# Altium schematic sheet STM32F1Debugger.SchDoc
size A4; SheetNumber: 1; SheetTotal: 16
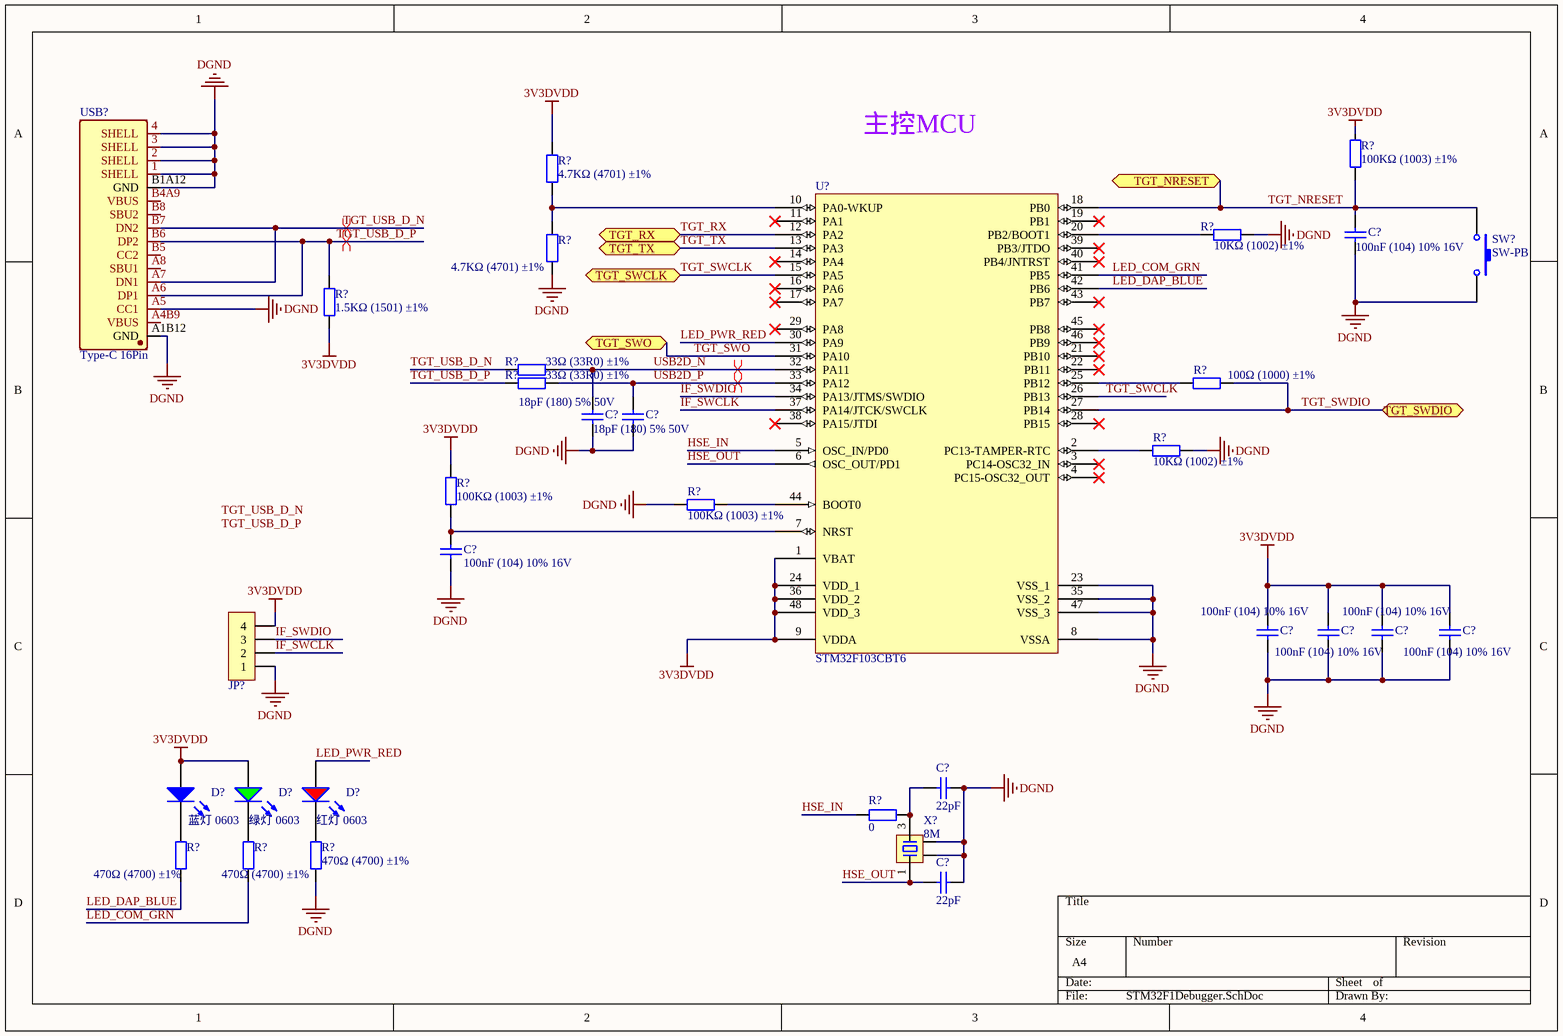
[diagram p0: STM32F1Debugger.SchDoc]

## Parts
(Parts that share a designator on the sheet are numbered #1, #2 ... from top to bottom, then left to right.)
C?#1  100nF (104) 10% 16V  [0402_C]
C?#2  18pF (180) 5% 50V  [0402_C]
C?#3  18pF (180) 5% 50V  [0402_C]
C?#4  100nF (104) 10% 16V  [0402_C]
C?#5  100nF (104) 10% 16V  [0402_C]
C?#6  100nF (104) 10% 16V  [0402_C]
C?#7  100nF (104) 10% 16V  [0402_C]
C?#8  100nF (104) 10% 16V  [0402_C]
C?#9  22pF  [0603_C]
C?#10  22pF  [0603_C]
D?#1  蓝灯 0603  [0603_LED_S1]
D?#2  绿灯 0603  [0603_LED_S1]
D?#3  红灯 0603  [0603_LED_S1]
JP?  HDR-1X4  [XH2.54-WI-4P]  (value not drawn)
R?#1  100KΩ (1003) ±1%  [0402_R]
R?#2  4.7KΩ (4701) ±1%  [0402_R]
R?#3  10KΩ (1002) ±1%  [0402_R]
R?#4  4.7KΩ (4701) ±1%  [0402_R]
R?#5  1.5KΩ (1501) ±1%  [0402_R]
R?#6  33Ω (33R0) ±1%  [0402_R]
R?#7  33Ω (33R0) ±1%  [0402_R]
R?#8  100Ω (1000) ±1%  [0402_R]
R?#9  10KΩ (1002) ±1%  [0402_R]
R?#10  100KΩ (1003) ±1%  [0402_R]
R?#11  100KΩ (1003) ±1%  [0402_R]
R?#12  0  [R 0603_L]
R?#13  470Ω (4700) ±1%  [0402_R]
R?#14  470Ω (4700) ±1%  [0402_R]
R?#15  470Ω (4700) ±1%  [0402_R]
SW?  SW-PB  [PB_TYCO_FSMSM]
U?  STM32F103CBT6  [STM32F103CBT6-Footprint-1]
USB?  Type-C 16Pin  [typec 16p]
X?  8M  [OSC 3225-4P]

## Ports
TGT_NRESET (bidir), TGT_RX (bidir), TGT_SWCLK (bidir), TGT_SWDIO (bidir), TGT_SWO (bidir), TGT_TX (bidir)

## Nets
3V3DVDD: C?#5.2 C?#6.2 C?#7.2 C?#8.2 D?#1.A D?#2.A JP?.4 R?#1.2 R?#2.2 R?#5.1 R?#10.2 U?.1(VBAT) U?.9(VDDA) U?.24(VDD_1) U?.36(VDD_2) U?.48(VDD_3)
DGND: C?#1.1 C?#2.1 C?#3.1 C?#4.1 C?#5.1 C?#6.1 C?#7.1 C?#8.1 C?#9.2 C?#10.2 JP?.1 R?#3.2 R?#4.1 R?#9.2 R?#11.2 R?#15.1 SW?.2 U?.8(VSSA) U?.23(VSS_1) U?.35(VSS_2) U?.47(VSS_3) USB?.1(SHELL) USB?.2(SHELL) USB?.3(SHELL) USB?.4(SHELL) USB?.A1B12(GND) USB?.A5(CC1) USB?.B1A12(GND) X?.2 X?.4
HSE_IN: R?#12.2 U?.5(OSC_IN/PD0)
HSE_OUT: C?#10.1 U?.6(OSC_OUT/PD1) X?.1
IF_SWCLK: JP?.2 U?.37(PA14/JTCK/SWCLK)
IF_SWDIO: JP?.3 U?.34(PA13/JTMS/SWDIO)
LED_COM_GRN: R?#14.1 U?.41(PB5)
LED_DAP_BLUE: R?#13.1 U?.42(PB6)
LED_PWR_RED: D?#3.A U?.30(PA9)
TGT_NRESET: C?#1.2 R?#1.1 SW?.1 U?.18(PB0) ; port TGT_NRESET
TGT_RX: U?.12(PA2) ; port TGT_RX
TGT_SWCLK: U?.15(PA5) U?.26(PB13) ; port TGT_SWCLK
TGT_SWDIO: R?#8.2 U?.27(PB14) ; port TGT_SWDIO
TGT_SWO: U?.31(PA10) ; port TGT_SWO
TGT_TX: U?.13(PA3) ; port TGT_TX
TGT_USB_D_N: R?#6.1 USB?.A7(DN1) USB?.B7(DN2)
TGT_USB_D_P: R?#5.2 R?#7.1 USB?.A6(DP1) USB?.B6(DP2)
USB2D_N: C?#2.2 R?#6.2 U?.32(PA11)
USB2D_P: C?#3.2 R?#7.2 U?.33(PA12)
NetC?#4_2: C?#4.2 R?#10.1 U?.7(NRST)
NetC?#9_1: C?#9.1 R?#12.1 X?.3
NetD?#1_K: D?#1.K R?#13.2
NetD?#2_K: D?#2.K R?#14.2
NetD?#3_K: D?#3.K R?#15.2
NetR?#2_1: R?#2.1 R?#4.2 U?.10(PA0-WKUP)
NetR?#3_1: R?#3.1 U?.20(PB2/BOOT1)
NetR?#8_1: R?#8.1 U?.25(PB12)
NetR?#9_1: R?#9.1 U?.2(PC13-TAMPER-RTC)
NetR?#11_1: R?#11.1 U?.44(BOOT0)

Not connected (* = marked no-connect by the designer): U? 3(PC14-OSC32_IN)* 4(PC15-OSC32_OUT)* 11(PA1)* 14(PA4)* 16(PA6)* 17(PA7)* 19(PB1)* 21(PB10)* 22(PB11)* 28(PB15)* 29(PA8)* 38(PA15/JTDI)* 39(PB3/JTDO)* 40(PB4/JNTRST)* 43(PB7)* 45(PB8)* 46(PB9)*; USB? A4B9(VBUS) A8(SBU1) B4A9(VBUS) B5(CC2) B8(SBU2)

## Layout directives
differential pair; differential pair class USB2Diff: TGT_USB_D_N, TGT_USB_D_P, USB2D_N, USB2D_P

## Notes on the sheet
- 主控MCU
- Labels drawn without touching a wire or pin: TGT_USB_D_N, TGT_USB_D_P

## Library data of the parts
C?#1 C?#4-C?#8 = 0402 100nF (104) 10% 16V: 贴片电容; ComponentLink1Description: 供应商链接; ComponentLink1URL: http://www.szlcsc.com/product/details_1877.html; Package: 0402; Supplier: LC; SuppliersPartNumber: C1525
C?#2 C?#3 = 0402 18pF (180) 5% 50V: 贴片电容; ComponentLink1Description: 供应商链接; ComponentLink1URL: http://www.szlcsc.com/product/details_1901.html; Package: 0402; Supplier: LC; SuppliersPartNumber: C1549
C?#9 C?#10 = Cap: Capacitor; Published: 8-Jun-2000; LatestRevisionDate: 17-Jul-2002; LatestRevisionNote: Re-released for DXP Platform.; PackageReference: RAD-0.3; Publisher: Altium Limited; Value: 22pF
D?#1 = 0603 蓝灯: 发光二极管; ComponentLink1Description: 供应商链接; ComponentLink1URL: http://www.szlcsc.com/product/details_73150.html; Package: 0603; Supplier: LC; SuppliersPartNumber: C72041
D?#2 = 0603 绿灯: 发光二极管; ComponentLink1Description: 供应商链接; ComponentLink1URL: http://www.szlcsc.com/product/details_73152.html; Package: 0603; Supplier: LC; SuppliersPartNumber: C72043
D?#3 = 0603 红灯: 发光二极管; ComponentLink1Description: 供应商链接; ComponentLink1URL: http://www.szlcsc.com/product/details_2659.html; Package: 0603; Supplier: LC; SuppliersPartNumber: C2286
JP? = Header 4: 4P接插件; 版权归属: 封装库来自淘宝 ID：黄晶宝石; BOM名称: 4P接插件; 学习资源: https://shop463601444.taobao.com
R?#1 R?#10 R?#11 = 0402 100KΩ (1003) 1%: 贴片电阻; ComponentLink1Description: 供应商链接; ComponentLink1URL: http://www.szlcsc.com/product/details_26484.html; Package: 0402; Supplier: LC; SuppliersPartNumber: C25741
R?#2 R?#4 = 0402 4.7KΩ (4701) 1%: 贴片电阻; ComponentLink1Description: 供应商链接; ComponentLink1URL: http://www.szlcsc.com/product/details_26643.html; Package: 0402; Supplier: LC; SuppliersPartNumber: C25900
R?#3 R?#9 = 0402 10KΩ (1002) 1%: 贴片电阻; ComponentLink1Description: 供应商链接; ComponentLink1URL: http://www.szlcsc.com/product/details_26487.html; Package: 0402; Supplier: LC; SuppliersPartNumber: C25744
R?#5 = 0402 1.5KΩ (1501) 1%: 贴片电阻; ComponentLink1Description: 供应商链接; ComponentLink1URL: http://www.szlcsc.com/product/details_26610.html; Package: 0402; Supplier: LC; SuppliersPartNumber: C25867
R?#6 R?#7 = 0402 33Ω (33R0) 1%: 贴片电阻; ComponentLink1Description: 供应商链接; ComponentLink1URL: http://www.szlcsc.com/product/details_25848.html; Package: 0402; Supplier: LC; SuppliersPartNumber: C25105
R?#8 = 0402 100Ω (1000) 1%: 贴片电阻; ComponentLink1Description: 供应商链接; ComponentLink1URL: http://www.szlcsc.com/product/details_25819.html; Package: 0402; Supplier: LC; SuppliersPartNumber: C25076
R?#12 = R: 贴片电阻; 版权归属: 来自淘宝 ID：黄晶宝石; 封装库来自淘宝卖家 ID：黄晶宝石: 其他店铺购入均为盗版，不享受售后技术支持服务，请立即申请退款; BOM名称: 贴片电阻; 联系售后: https://shop463601444.taobao.com
R?#13-R?#15 = 0402 470Ω (4700) 1%: 贴片电阻; ComponentLink1Description: 供应商链接; ComponentLink1URL: http://www.szlcsc.com/product/details_25860.html; Package: 0402; Supplier: LC; SuppliersPartNumber: C25117
SW? = SW-PB: Switch; Published: 24-Mar-1999; LatestRevisionDate: 17-Jul-2002; LatestRevisionNote: Re-released for DXP Platform.; PackageReference: SPST-2; Publisher: Altium Limited; PackageDescription: Switch; 2 Leads
U? = CMP-020-00023-1: ARM® 32-bit Cortex®-M3 CPU Core,72 MHz maximum frequency; RAM Size: 64 or 128 Kbytes of Flash memory, 20 Kbytes of SRAM; Pins: 48; Case/Package: LQFP48
USB? = TYPE-C16PIN: ComponentLink1Description: 嘉立创; ComponentLink1URL: https://item.szlcsc.com/372551.html; Datasheet: javascript:fileModule.downloadFileNoRemark('https://atta.szlcsc.com/upload/public/pdf/source/20190521/C393939_7B9043D4CF1026AF443AB60D91FBCD5C.pdf%3FExpires%3D4070880000%26OSSAccessKeyId%3DLTAIJDIkh7KmGS1H%26Signature%3DcQcE%252FNX1dDNXtBUBosJ1RmuR16Q%253D%26response-content-disposition%3Dattachment%253Bfilename%253DC393939_TYPE-C%2525E6%2525AF%25258D%2525E5%2525BA%2525A716PIN%2525E5%2525BF%2525AB%2525E5%252585%252585%2525E9%252597%2525AA%2525E5%252585%252585USB3.0%2525E6%2525B2%252589%2525E6%25259D%2525BF%2525E6%2525AF%25258D%2525E5%2525BA%2525A7%2525E8%2525BF%25259E%2525E6%25258E%2525A5%2525E5%252599%2525A8_2019-05-21.PDF','60D38A6780882313296C67311B688FC3','new_pdf_doc_pdf','');buriedPoint({ty: 'click',op: 'download_pdf',data: 'C393939'});
X? = XTAL-4P: 4脚无源晶振; 版权归属: 封装库来自淘宝卖家 ID：黄晶宝石; BOM名称: 4脚无源晶振; 学习资源: https://shop463601444.taobao.com